# Altium schematic sheet 9.BOOT.SchDoc: MC-IMX6UL-CORE
size A4; DrawnBy: DrawnBy; DocumentNumber: MC-IMX6UL-CORE; Revision: V1.1; SheetNumber: 9 of 9
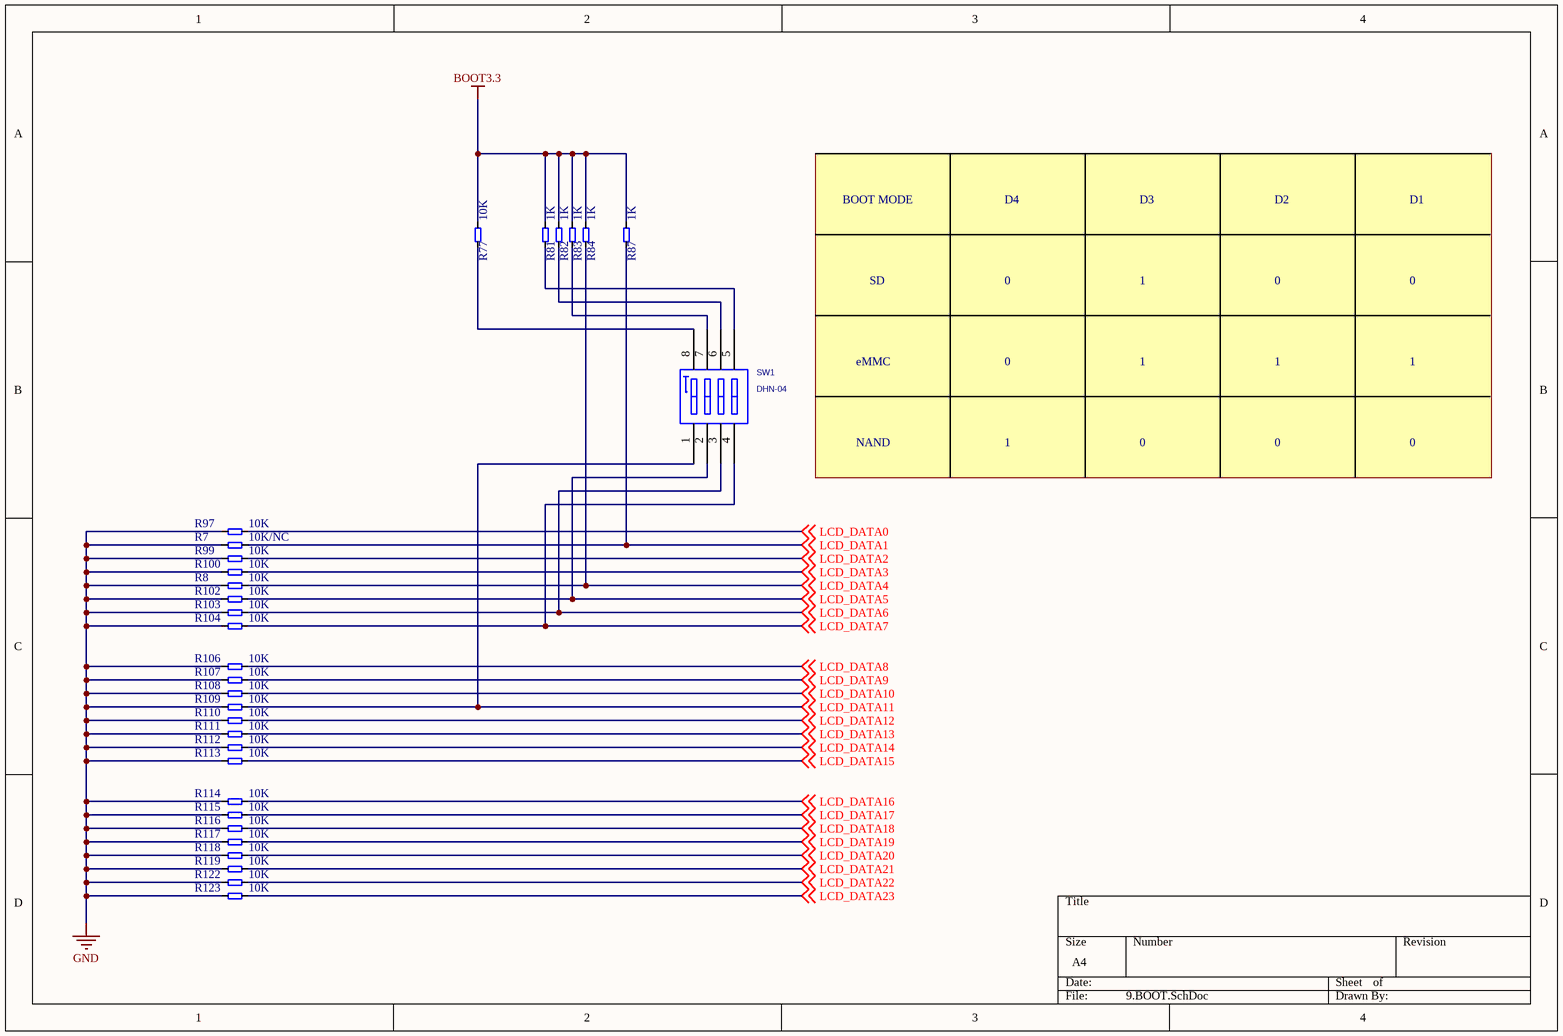
[diagram p0: 9.BOOT.SchDoc]

## Parts
R7  10K/NC  [0603R]
R8  10K  [0603R]
R77  10K  [0603R]
R81  1K  [0603R]
R82  1K  [0603R]
R83  1K  [0603R]
R84  1K  [0603R]
R87  1K  [0603R]
R97  10K  [0603R]
R99  10K  [0603R]
R100  10K  [0603R]
R102  10K  [0603R]
R103  10K  [0603R]
R104  10K  [0603R]
R106  10K  [0603R]
R107  10K  [0603R]
R108  10K  [0603R]
R109  10K  [0603R]
R110  10K  [0603R]
R111  10K  [0603R]
R112  10K  [0603R]
R113  10K  [0603R]
R114  10K  [0603R]
R115  10K  [0603R]
R116  10K  [0603R]
R117  10K  [0603R]
R118  10K  [0603R]
R119  10K  [0603R]
R122  10K  [0603R]
R123  10K  [0603R]
SW1  DHN-04  [SW-4P]

## Nets
BOOT3.3: R77.2 R81.2 R82.2 R83.2 R84.2 R87.2
GND: R7.1 R8.1 R97.1 R99.1 R100.1 R102.1 R103.1 R104.1 R106.1 R107.1 R108.1 R109.1 R110.1 R111.1 R112.1 R113.1 R114.1 R115.1 R116.1 R117.1 R118.1 R119.1 R122.1 R123.1
LCD_DATA0: R97.2 ; off-sheet LCD_DATA0
LCD_DATA1: R7.2 R87.1 ; off-sheet LCD_DATA1
LCD_DATA2: R99.2 ; off-sheet LCD_DATA2
LCD_DATA3: R100.2 ; off-sheet LCD_DATA3
LCD_DATA4: R8.2 R84.1 ; off-sheet LCD_DATA4
LCD_DATA5: R102.2 SW1.2(A2) ; off-sheet LCD_DATA5
LCD_DATA6: R103.2 SW1.3(A3) ; off-sheet LCD_DATA6
LCD_DATA7: R104.2 SW1.4(A4) ; off-sheet LCD_DATA7
LCD_DATA8: R106.2 ; off-sheet LCD_DATA8
LCD_DATA9: R107.2 ; off-sheet LCD_DATA9
LCD_DATA10: R108.2 ; off-sheet LCD_DATA10
LCD_DATA11: R109.2 SW1.1(A1) ; off-sheet LCD_DATA11
LCD_DATA12: R110.2 ; off-sheet LCD_DATA12
LCD_DATA13: R111.2 ; off-sheet LCD_DATA13
LCD_DATA14: R112.2 ; off-sheet LCD_DATA14
LCD_DATA15: R113.2 ; off-sheet LCD_DATA15
LCD_DATA16: R114.2 ; off-sheet LCD_DATA16
LCD_DATA17: R115.2 ; off-sheet LCD_DATA17
LCD_DATA18: R116.2 ; off-sheet LCD_DATA18
LCD_DATA19: R117.2 ; off-sheet LCD_DATA19
LCD_DATA20: R118.2 ; off-sheet LCD_DATA20
LCD_DATA21: R119.2 ; off-sheet LCD_DATA21
LCD_DATA22: R122.2 ; off-sheet LCD_DATA22
LCD_DATA23: R123.2 ; off-sheet LCD_DATA23
NetR77_1: R77.1 SW1.8(B1)
NetR81_1: R81.1 SW1.5(B4)
NetR82_1: R82.1 SW1.6(B3)
NetR83_1: R83.1 SW1.7(B2)

## Notes on the sheet
- BOOT MODE
- D4
- D3
- D2
- D1
- SD
- 0
- 1
- eMMC
- NAND

## Library data of the parts
R7 R8 R77 R81-R84 R87 R97 R99 R100 R102-R104 R106-R119 R122 R123 = 电阻
SW1 = SW_DIP-4_SM: SW 4P SPST DIP 25MA 24V SMT; CLASS: IC; AGILE_PN: 510-77990; MFG_NAME01: DIPTRONICS MANUFACTURING; MFG_PN01: DHN-04-V; CAD_APPROVED: Yes; ROHS: Yes; HEIGHT: 1.65 MM